# Altium project RIAA_CorrectieFilter2.PrjPcb
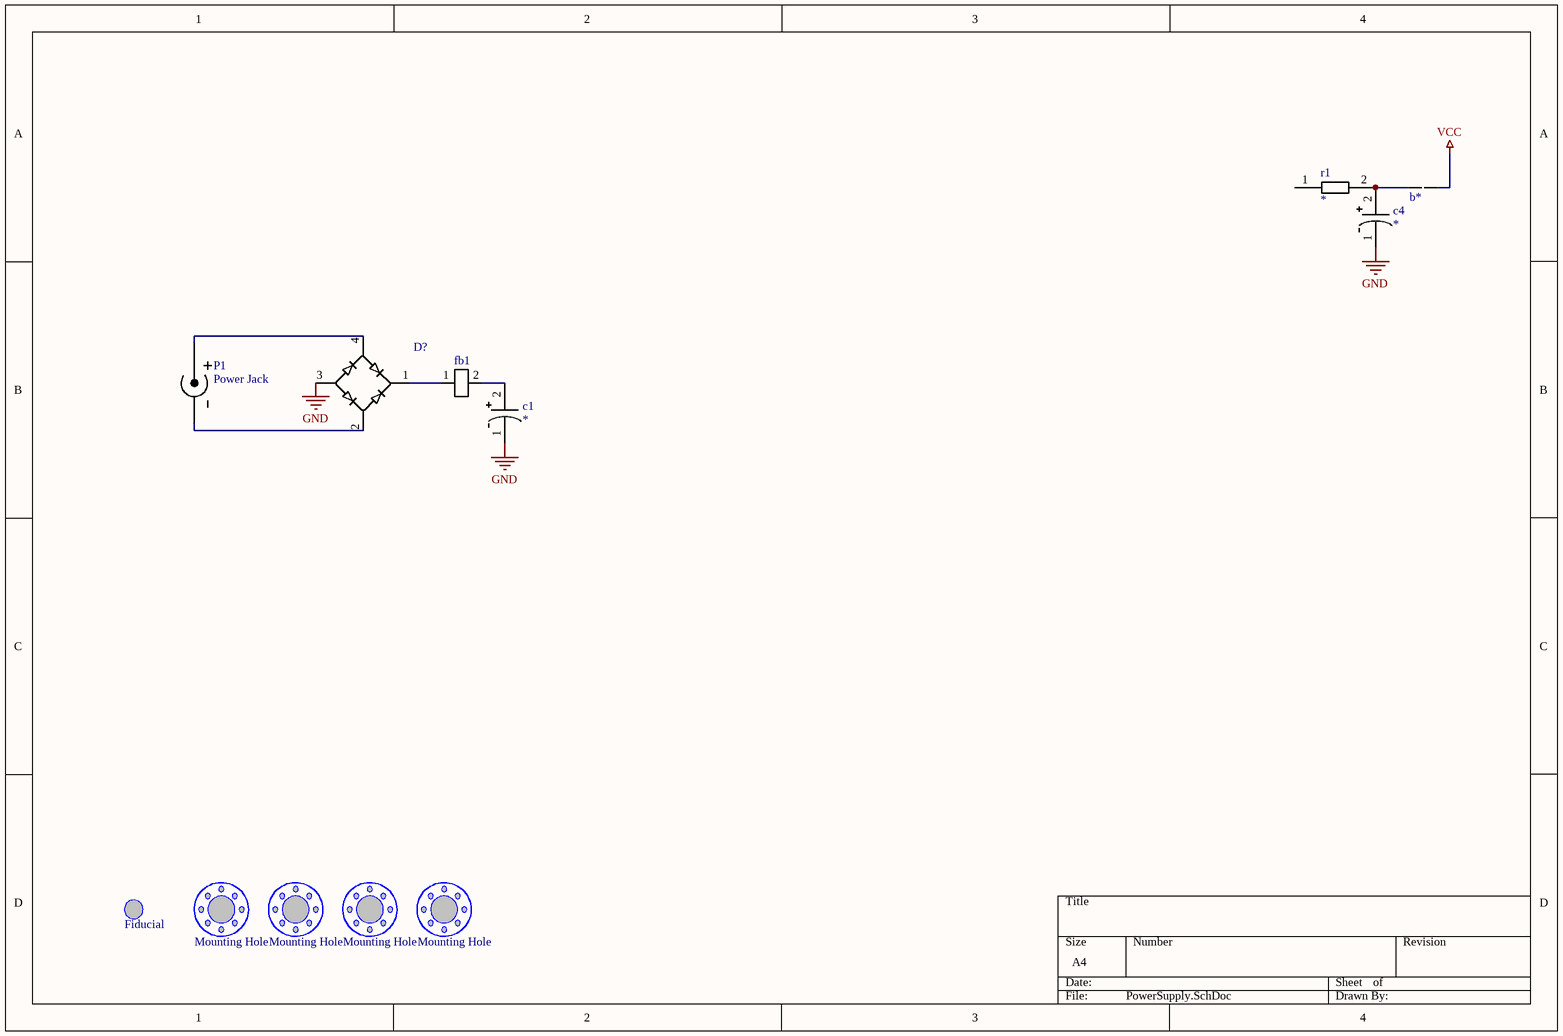
[diagram p0: PowerSupply.SchDoc]
2 sheets, 41 parts. Net scope: global (net labels, ports and power ports of the same name join across sheets).
Board file: RIAA_Correctiefilter2.PcbDoc
Sheets:
  PowerSupply.SchDoc
  Preamp&Filter.SchDoc

## Sheet PowerSupply.SchDoc
size A4

### Parts
(Parts that share a designator on the sheet are numbered #1, #2 ... from top to bottom, then left to right.)
b*  Solder Bridge  [Solder Bridge]  (value not drawn)
c1  *  [Elco-D]
c4  *  [Elco-D]
D?  Bridge Rectifier  [SOT-143]  (value not drawn)
f*  Fiducial  [Fiducial]
fb1  *  [0805]  (value not drawn)
H*  Mounting Hole  [Mounting Hole]
H*?#1  Mounting Hole  [Mounting Hole]
H*?#2  Mounting Hole  [Mounting Hole]
H*?#3  Mounting Hole  [Mounting Hole]
P1  Power Jack  [Power Jack]
r1  *  [0805]

### Nets
GND: c1.1 c4.1 D?.3
VCC: b*.2
Netb*_1: b*.1 c4.2 r1.2
Netc1_2: c1.2 fb1.2
NetD?_1: D?.1 fb1.1
NetD?_2: D?.2 P1.2(GND)
NetD?_4: D?.4 P1.1(V+)

Not connected (* = marked no-connect by the designer): r1 1

### Library data of the parts
c1 c4 = Elco D: Elco size D 6.3x5.4
fb1 = Ferrite Bead 0805 Package: Ferrite Bead
P1 = DC Power Jack
r1 = 0805 Resistor: 0805 Resistor package

## Sheet Preamp&Filter.SchDoc
size A4
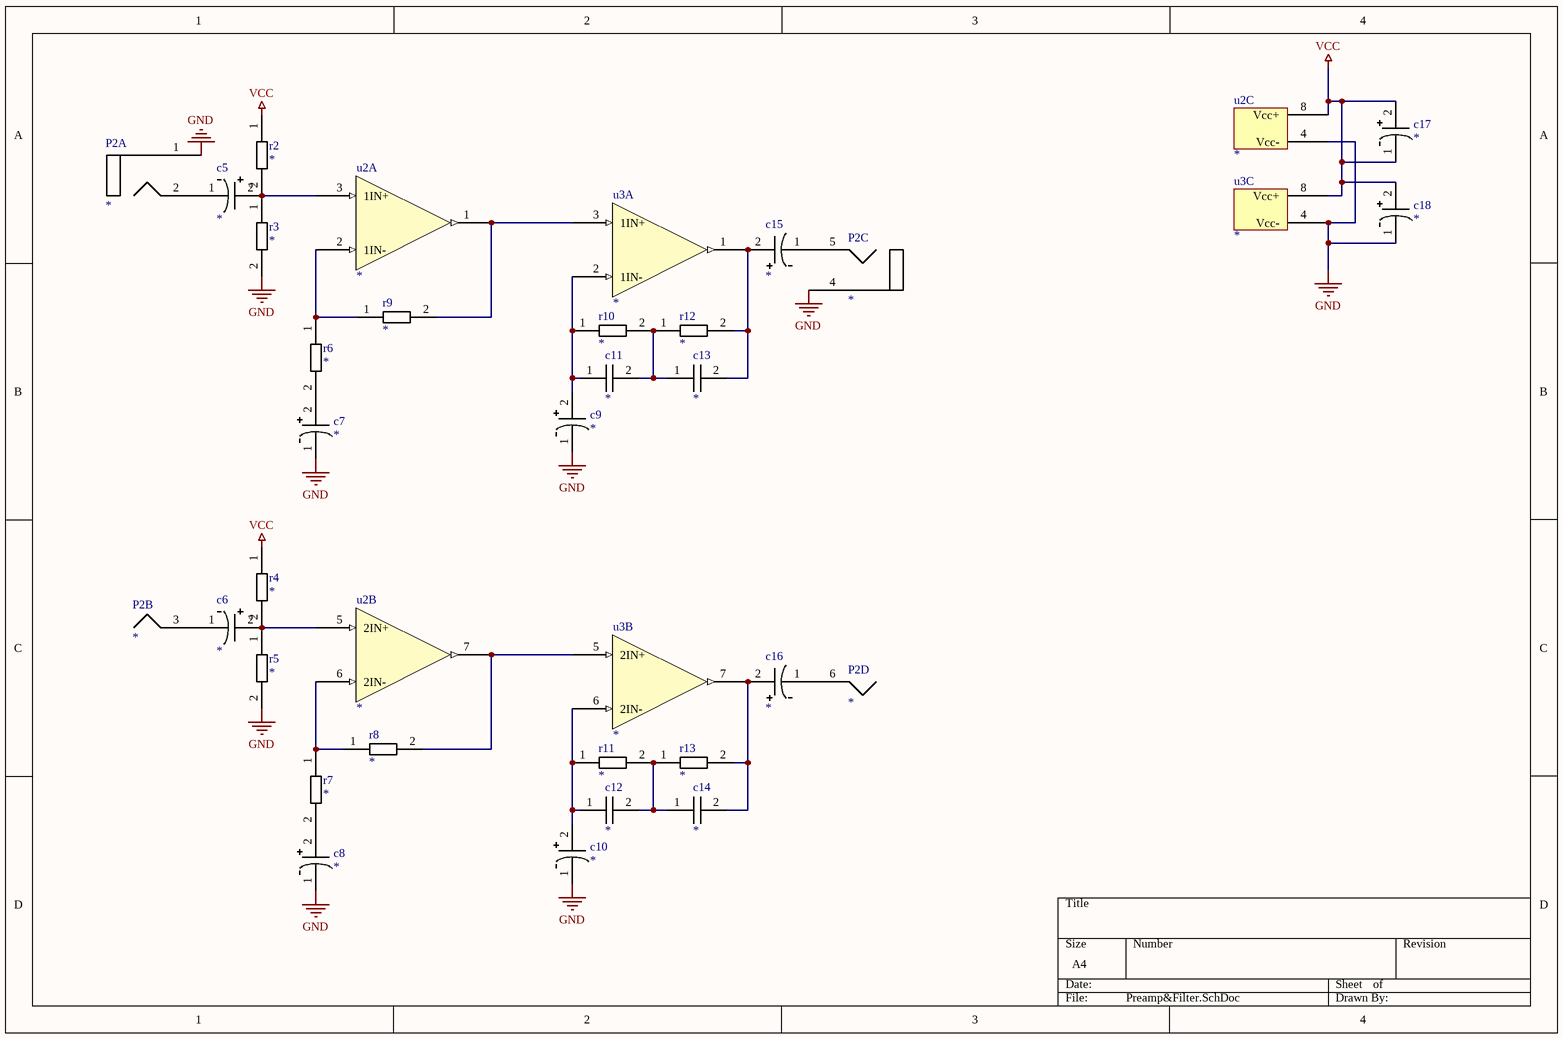
[diagram p1: Preamp&Filter.SchDoc]

### Parts
c5  *  [Elco-B]
c6  *  [Elco-B]
c7  *  [Elco-B]
c8  *  [Elco-B]
c9  *  [Elco-D]
c10  *  [Elco-D]
c11  *  [0805]
c12  *  [0805]
c13  *  [0805]
c14  *  [0805]
c15  *  [Elco-C]
c16  *  [Elco-C]
c17  *  [Elco-D]
c18  *  [Elco-D]
P2  *  [RCA 4-way]  (parts A,B,C,D of 4)
r2  *  [0805]
r3  *  [0805]
r4  *  [0805]
r5  *  [0805]
r6  *  [0805]
r7  *  [0805]
r8  *  [0805]
r9  *  [0805]
r10  *  [0805]
r11  *  [0805]
r12  *  [0805]
r13  *  [0805]
u2  *  [R-PDSO-G8-P127d620x530]  (parts A,B,C of 3)
u3  *  [R-PDSO-G8-P127d620x530]  (parts A,B,C of 3)

### Nets
GND: c7.1 c8.1 c9.1 c10.1 c18.1 P2.1 P2.4 r3.2 r5.2 u2.4(Vcc-) u3.4(Vcc-)
VCC: c17.1 c17.2 c18.2 r2.1 r4.1 u2.8(Vcc+) u3.8(Vcc+)
Netc5_1: c5.1 P2.2
Netc5_2: c5.2 r2.2 r3.1 u2.3(1IN+)
Netc6_1: c6.1 P2.3
Netc6_2: c6.2 r4.2 r5.1 u2.5(2IN+)
Netc7_2: c7.2 r6.2
Netc8_2: c8.2 r7.2
Netc9_2: c9.2 c11.1 r10.1 u3.2(1IN-)
Netc10_2: c10.2 c12.1 r11.1 u3.6(2IN-)
Netc11_2: c11.2 c13.1 r10.2 r12.1
Netc12_2: c12.2 c14.1 r11.2 r13.1
Netc13_2: c13.2 c15.2 r12.2 u3.1(1OUT)
Netc14_2: c14.2 c16.2 r13.2 u3.7(2OUT)
Netc15_1: c15.1 P2.5
Netc16_1: c16.1 P2.6
Netr6_1: r6.1 r9.1 u2.2(1IN-)
Netr7_1: r7.1 r8.1 u2.6(2IN-)
Netr8_2: r8.2 u2.7(2OUT) u3.5(2IN+)
Netr9_2: r9.2 u2.1(1OUT) u3.3(1IN+)

### Library data of the parts
c5-c8 = Elco B
c9 c10 c17 c18 = Elco D: Elco size D 6.3x5.4
c11-c14 = 0805 Capacitor: 0805 Capacitor Package
c15 c16 = Elco C
P2 = PSG01551: 4-way RCA connector
r2-r13 = 0805 Resistor: 0805 Resistor package
u2 = NE5532x: Dual Low-Noise OpAmp
u3 = TL027x: Low-Noise JFET-input OpAmp

## Nets that join several sheets
GND: PowerSupply (c1.1 c4.1 D?.3), Preamp&Filter (11 pins)
VCC: PowerSupply (b*.2), Preamp&Filter (7 pins)